# Altium project AntiAliasingFilter.PrjPcb
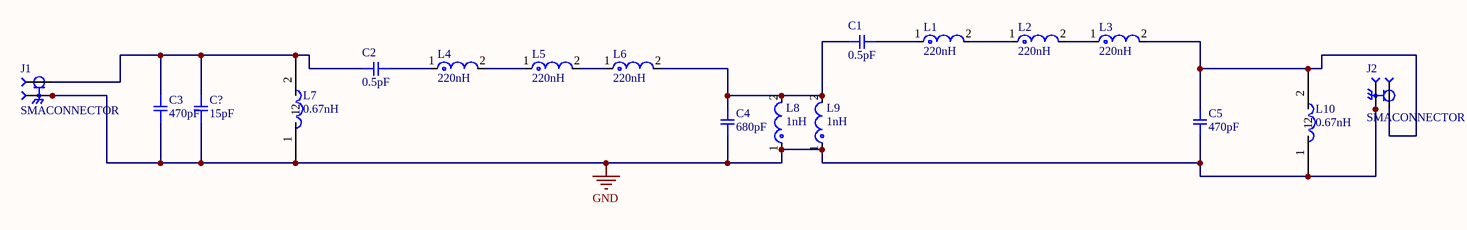
[diagram p0: Sheet2.SchDoc]
1 sheet, 18 parts. Net scope: global (net labels, ports and power ports of the same name join across sheets).
Board file: PCB2.PcbDoc

## Sheet Sheet2.SchDoc
size A4

### Parts
C1  0.5pF  [SMD-0402C]
C2  0.5pF  [SMD-0402C]
C3  470pF  [SMD-0402C]
C4  680pF  [SMD-0402C]
C5  470pF  [SMD-0402C]
C?  15pF  [SMD-0402C]
J1  SMACONNECTOR  [LPRS_SMACONNECTOR]
J2  SMACONNECTOR  [LPRS_SMACONNECTOR]
L1  220nH  [FP-LQG18HH_00-MFG]
L2  220nH  [FP-LQG18HH_00-MFG]
L3  220nH  [FP-LQG18HH_00-MFG]
L4  220nH  [FP-LQG18HH_00-MFG]
L5  220nH  [FP-LQG18HH_00-MFG]
L6  220nH  [FP-LQG18HH_00-MFG]
L7  0.67nH  [0302CS SERIES]
L8  1nH  [FP-LQG18HH_00-MFG]
L9  1nH  [FP-LQG18HH_00-MFG]
L10  0.67nH  [0302CS SERIES]

### Nets
GND: C3.1 C4.1 C5.1 C?.1 J1.2 J1.3 J1.4 J1.5 J2.2 J2.3 J2.4 J2.5 L7.1 L8.1 L9.1 L10.1
NetC1_1: C1.1 L1.1
NetC1_2: C1.2 C4.2 L6.2 L8.2 L9.2
NetC2_1: C2.1 L4.1
NetC2_2: C2.2 C3.2 C?.2 J1.1 L7.2
NetC5_2: C5.2 J2.1 L3.2 L10.2
NetL1_2: L1.2 L2.1
NetL2_2: L2.2 L3.1
NetL4_2: L4.2 L5.1
NetL5_2: L5.2 L6.1

### Library data of the parts
C1-C5 C? = GCM155R71H153KA55D: CAP CER 0.015UF 50V X7R 0402; Manufacturer: Murata Electronics North America; Factory Stock: 0; Unit Price (USD): 0.1; Minimum Quantity: 1; Value: 0.015µF; Tolerance: ±10%; Datasheets: http://www.murata.com/~/media/webrenewal/support/library/catalog/products/capacitor/mlcc/c03e.ashx; Image: //media.digikey.com/Renders/Murata%20Renders/ZRB-SERIES-0402.jpg; Digi-Key Part Number: 490-11956-1-ND; Part Number: GCM155R71H153KA55D; Quantity Available: 31530; @ qty: 0; Packaging: Cut Tape (CT); Series: GCM; Part Status: Active; Voltage: 50V; Temperature Coefficient: X7R; Operating Temperature: -55°C ~ 125°C; Features: -; Ratings: AEC-Q200; Applications: Automotive; Mounting Type: Surface Mount, MLCC; Package / Case: 0402 (1005 Metric); Size / Dimension: 0.039" L x 0.020" W (1.00mm x 0.50mm); Height - Seated (Max): -; Thickness (Max): 0.022" (0.55mm); Lead Spacing: -; Lead Style: -
J1 J2 = SMACONNECTOR: SMA female RF coaxial connector for SMA male RF antennas.; Package: None; Price: None; Value: *; MP: SMACONNECTOR; Availability: Unavailable
L1-L6 L8 L9 = CMP-06042-016493-1: Multilayer type RF Inductor 1.8nH ±0.3nH 0.1Ω 1100mA 0603; Core Material: Air; Test Frequency: 100MHz; Shielding: Unshielded; Max DC Current: 500mA; DC Resistance (DCR): 100mR; Q Factor: 12; Self Resonant Frequency: 6GHz; Height - Seated (Max): 0.037inch; Series: LQG18H; Termination: SMD/SMT; Height: 0.8mm; Length: 1.6mm; Number of Pins: 2; Max Operating Temperature: 85°C; Case Code (Imperial): 0603; Military Standard: Not; Case Code (Metric): 1608; Radiation Hardening: No; REACH SVHC: No SVHC; Package Quantity: 4000; Packaging: Tape and Reel; Mount: Surface Mount; Lead Free: Lead Free; Case/Package: 0603; RoHS Compliant: Yes; Min Operating Temperature: -55°C; DC Current: 500mA; Current Rating: 500mA; Depth: 0.95mm; Rated Current-Max: 500mA; Inductance: 1.8nH; Width: 0.8mm
L7 L10 = 0302CS-N67XMB